# EAGLE schematic v1.1_P (EAGLE 9.1.3)
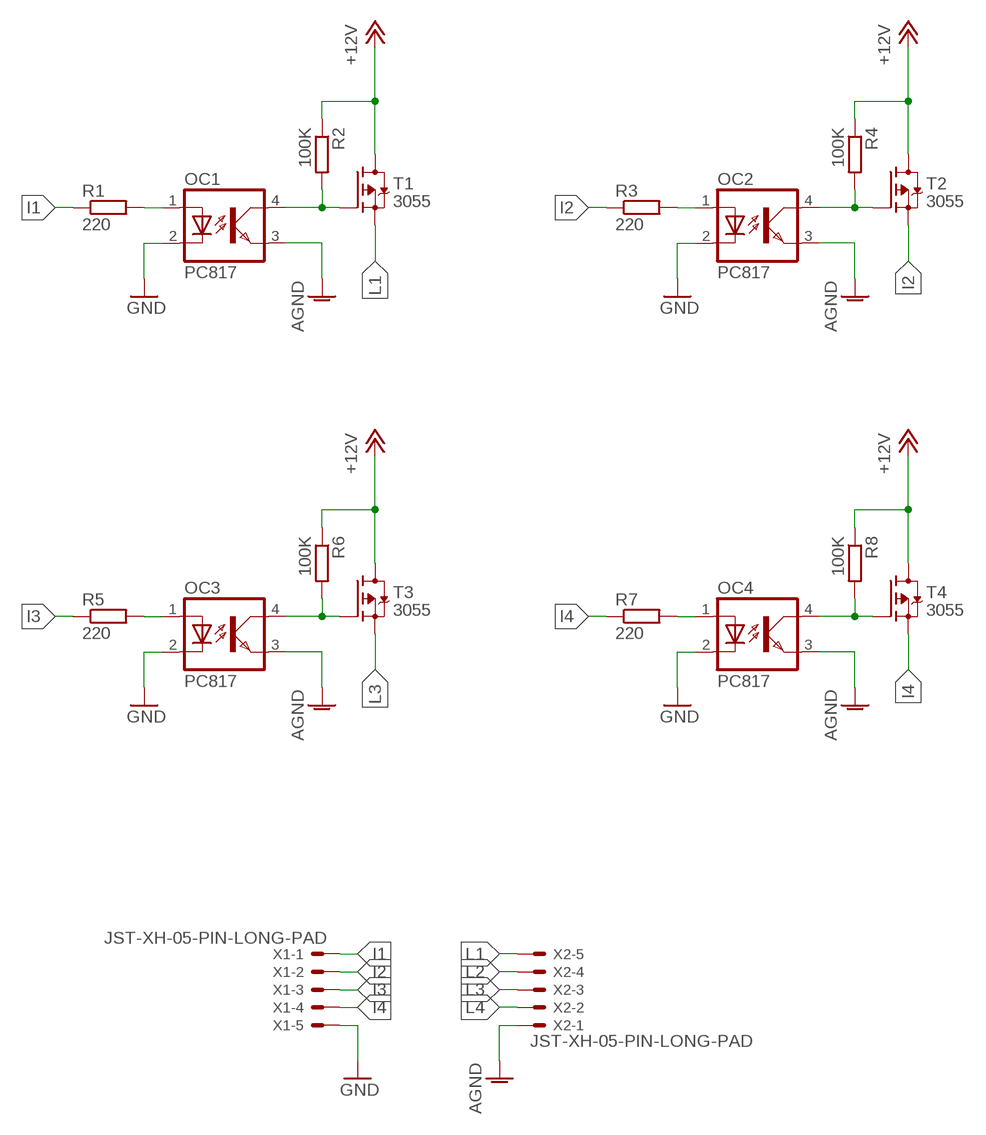
[diagram p0: schematic, sheet 1]

## Parts
OC1  PC817  [DIL04]
OC2  PC817  [DIL04]
OC3  PC817  [DIL04]
OC4  PC817  [DIL04]
R1  220  R-EU_R0603  [R0603]
R2  100K  R-EU_R0603  [R0603]
R3  220  R-EU_R0603  [R0603]
R4  100K  R-EU_R0603  [R0603]
R5  220  R-EU_R0603  [R0603]
R6  100K  R-EU_R0603  [R0603]
R7  220  R-EU_R0603  [R0603]
R8  100K  R-EU_R0603  [R0603]
T1  3055  MOSFET_P_SOT223  [MOSFET_P_SOT223]
T2  3055  MOSFET_P_SOT223  [MOSFET_P_SOT223]
T3  3055  MOSFET_P_SOT223  [MOSFET_P_SOT223]
T4  3055  MOSFET_P_SOT223  [MOSFET_P_SOT223]
X1  JST-XH-05-PIN-LONG-PAD  [JST-XH-05-PACKAGE-LONG-PAD]
X2  JST-XH-05-PIN-LONG-PAD  [JST-XH-05-PACKAGE-LONG-PAD]

## Nets
+12V: R2.1 R4.1 R6.1 R8.1 T1.2(D) T1.4(D) T2.2(D) T2.4(D) T3.2(D) T3.4(D) T4.2(D) T4.4(D)
AGND: OC1.3(EMIT) OC2.3(EMIT) OC3.3(EMIT) OC4.3(EMIT) X2.1
GND: OC1.2(C) OC2.2(C) OC3.2(C) OC4.2(C) X1.5
I1: R1.1 X1.1
I2: R3.1 T2.3(S) X1.2
I3: R5.1 X1.3
I4: R7.1 T4.3(S) X1.4
L1: T1.3(S) X2.5
L2: X2.4
L3: T3.3(S) X2.3
L4: X2.2
N$1: OC1.1(A) R1.2
N$2: OC1.4(COL) R2.2 T1.1(G)
N$4: OC2.1(A) R3.2
N$5: OC2.4(COL) R4.2 T2.1(G)
N$6: OC3.1(A) R5.2
N$7: OC3.4(COL) R6.2 T3.1(G)
N$8: OC4.1(A) R7.2
N$9: OC4.4(COL) R8.2 T4.1(G)

## Library data of the parts
OC1-OC4 = optocoupler-3-jcn:PC817: SHARP OPTO COUPLER
R1-R8 = resistor:R-EU_: RESISTOR, European symbol
T1-T4 = FracktalWorks:MOSFET_P_SOT223: MOSFET P channel SOT-223 device
X1 X2 = Rembrandt:JST-XH-05-PIN: JST XH Connector 2 Pin Wire to board connector. Pitch: 2,54 mm, (0.100") Number of pins: 5 Created by Rembrandt Electronics www.rembrandtelectronics.com